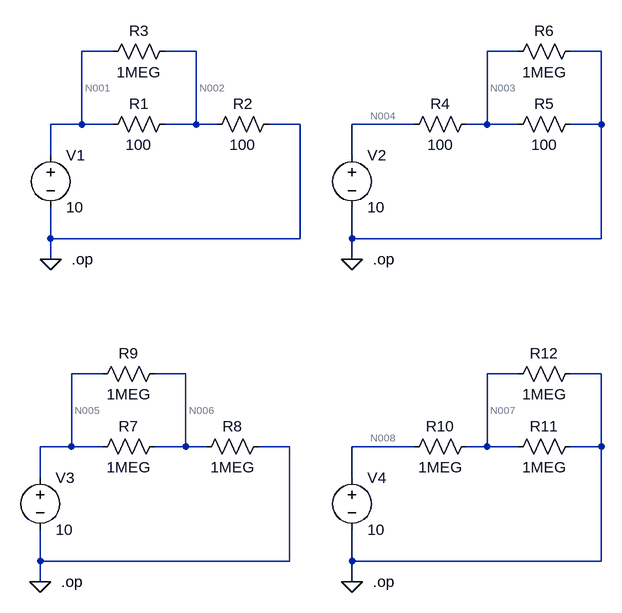
[diagram p0: schematic R_voltmeter=1M.asc]
R_voltmeter=1M.asc, the LTspice schematic file:
Version 4
SHEET 1 880 680
WIRE -32 -176 -80 -176
WIRE 96 -176 48 -176
WIRE 592 -176 544 -176
WIRE 720 -176 672 -176
WIRE -80 -64 -80 -176
WIRE -80 -64 -128 -64
WIRE -32 -64 -80 -64
WIRE 96 -64 96 -176
WIRE 96 -64 48 -64
WIRE 128 -64 96 -64
WIRE 256 -64 208 -64
WIRE 432 -64 336 -64
WIRE 544 -64 544 -176
WIRE 544 -64 512 -64
WIRE 592 -64 544 -64
WIRE 720 -64 720 -176
WIRE 720 -64 672 -64
WIRE -128 -16 -128 -64
WIRE 336 -16 336 -64
WIRE -128 112 -128 64
WIRE 256 112 256 -64
WIRE 256 112 -128 112
WIRE 336 112 336 64
WIRE 720 112 720 -64
WIRE 720 112 336 112
WIRE -128 144 -128 112
WIRE 336 144 336 112
WIRE -48 320 -96 320
WIRE 80 320 32 320
WIRE 592 320 544 320
WIRE 720 320 672 320
WIRE -96 432 -96 320
WIRE -96 432 -144 432
WIRE -48 432 -96 432
WIRE 80 432 80 320
WIRE 80 432 32 432
WIRE 112 432 80 432
WIRE 240 432 192 432
WIRE 432 432 336 432
WIRE 544 432 544 320
WIRE 544 432 512 432
WIRE 592 432 544 432
WIRE 720 432 720 320
WIRE 720 432 672 432
WIRE -144 480 -144 432
WIRE 336 480 336 432
WIRE -144 608 -144 560
WIRE 240 608 240 432
WIRE 240 608 -144 608
WIRE 336 608 336 560
WIRE 720 608 720 432
WIRE 720 608 336 608
WIRE -144 640 -144 608
WIRE 336 640 336 608
FLAG -128 144 0
FLAG 336 144 0
FLAG -144 640 0
FLAG 336 640 0
DATAFLAG -80 -176 ""
DATAFLAG 96 -176 ""
DATAFLAG 544 -176 ""
DATAFLAG 720 -176 ""
DATAFLAG -96 320 ""
DATAFLAG 80 320 ""
DATAFLAG 544 320 ""
DATAFLAG 720 320 ""
SYMBOL voltage -128 -32 R0
WINDOW 123 0 0 Left 2
WINDOW 39 0 0 Left 2
SYMATTR InstName V1
SYMATTR Value 10
SYMBOL res -48 -48 R270
WINDOW 0 32 56 VTop 2
WINDOW 3 0 56 VBottom 2
SYMATTR InstName R1
SYMATTR Value 100
SYMBOL res 112 -48 R270
WINDOW 0 32 56 VTop 2
WINDOW 3 0 56 VBottom 2
SYMATTR InstName R2
SYMATTR Value 100
SYMBOL res -48 -160 R270
WINDOW 0 32 56 VTop 2
WINDOW 3 0 56 VBottom 2
SYMATTR InstName R3
SYMATTR Value 1MEG
SYMBOL voltage 336 -32 R0
WINDOW 123 0 0 Left 2
WINDOW 39 0 0 Left 2
SYMATTR InstName V2
SYMATTR Value 10
SYMBOL res 416 -48 R270
WINDOW 0 32 56 VTop 2
WINDOW 3 0 56 VBottom 2
SYMATTR InstName R4
SYMATTR Value 100
SYMBOL res 576 -48 R270
WINDOW 0 32 56 VTop 2
WINDOW 3 0 56 VBottom 2
SYMATTR InstName R5
SYMATTR Value 100
SYMBOL res 576 -160 R270
WINDOW 0 32 56 VTop 2
WINDOW 3 0 56 VBottom 2
SYMATTR InstName R6
SYMATTR Value 1MEG
SYMBOL voltage -144 464 R0
WINDOW 123 0 0 Left 2
WINDOW 39 0 0 Left 2
SYMATTR InstName V3
SYMATTR Value 10
SYMBOL res -64 448 R270
WINDOW 0 32 56 VTop 2
WINDOW 3 0 56 VBottom 2
SYMATTR InstName R7
SYMATTR Value 1MEG
SYMBOL res 96 448 R270
WINDOW 0 32 56 VTop 2
WINDOW 3 0 56 VBottom 2
SYMATTR InstName R8
SYMATTR Value 1MEG
SYMBOL res -64 336 R270
WINDOW 0 32 56 VTop 2
WINDOW 3 0 56 VBottom 2
SYMATTR InstName R9
SYMATTR Value 1MEG
SYMBOL voltage 336 464 R0
WINDOW 123 0 0 Left 2
WINDOW 39 0 0 Left 2
SYMATTR InstName V4
SYMATTR Value 10
SYMBOL res 416 448 R270
WINDOW 0 32 56 VTop 2
WINDOW 3 0 56 VBottom 2
SYMATTR InstName R10
SYMATTR Value 1MEG
SYMBOL res 576 448 R270
WINDOW 0 32 56 VTop 2
WINDOW 3 0 56 VBottom 2
SYMATTR InstName R11
SYMATTR Value 1MEG
SYMBOL res 576 336 R270
WINDOW 0 32 56 VTop 2
WINDOW 3 0 56 VBottom 2
SYMATTR InstName R12
SYMATTR Value 1MEG
TEXT -96 144 Left 2 !.op
TEXT 368 144 Left 2 !.op
TEXT -112 640 Left 2 !.op
TEXT 368 640 Left 2 !.op

The netlist it stands for:
* R_voltmeter=1M.asc
V1 N001 0 10
R1 N001 N002 100
R2 N002 0 100
R3 N001 N002 1MEG
V2 N004 0 10
R4 N004 N003 100
R5 N003 0 100
R6 N003 0 1MEG
V3 N005 0 10
R7 N005 N006 1MEG
R8 N006 0 1MEG
R9 N005 N006 1MEG
V4 N008 0 10
R10 N008 N007 1MEG
R11 N007 0 1MEG
R12 N007 0 1MEG
.op
.op
.op
.op
.backanno
.end

* Results of the author's LTspice run, read from the files saved beside the schematic
* Operating Point:
*   V(n001) = 10 V
*   V(n002) = 5 V
*   V(n004) = 10 V
*   V(n003) = 5 V
*   V(n005) = 10 V
*   V(n006) = 6.667 V
*   V(n008) = 10 V
*   V(n007) = 3.333 V
*   I(R12) = 3.333 µA
*   I(R11) = 3.333 µA
*   I(R10) = 6.667 µA
*   I(R9) = 3.333 µA
*   I(R8) = 6.667 µA
*   I(R7) = 3.333 µA
*   I(R6) = 5 µA
*   I(R5) = 50 mA
*   I(R4) = 50 mA
*   I(R3) = 5 µA
*   I(R2) = 50 mA
*   I(R1) = 50 mA
*   I(V4) = -6.667 µA
*   I(V3) = -6.667 µA
*   I(V2) = -50 mA
*   I(V1) = -50 mA